# Altium schematic sheet V_BACKUP.SchDoc
size A4; SheetNumber: 18; SheetTotal: 21
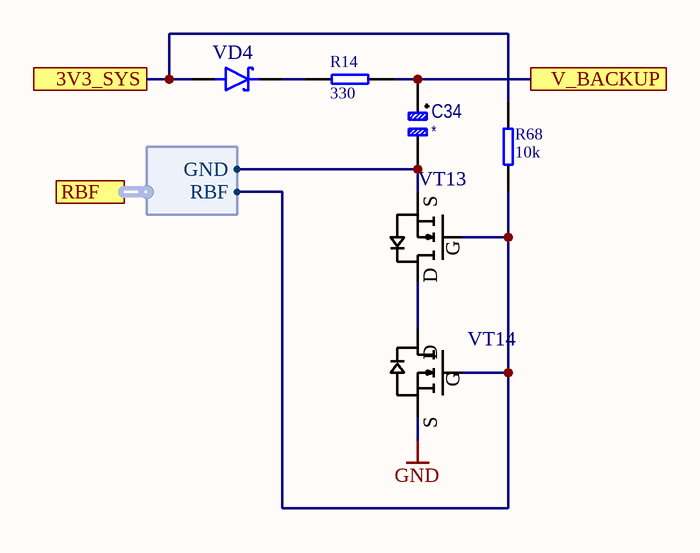
[diagram p0: V_BACKUP.SchDoc]

## Parts
C34  *  [DCS5R5224H]
R14  value 330  [RES 0402]
R68  value 10k  [RES 0402]
VD4  (no value)  [SOD-123]
VT13  2N7002  [SOT23-3]  (value not drawn)
VT14  2N7002  [SOT23-3]  (value not drawn)

## Ports
3V3_SYS, RBF (harness RBF), V_BACKUP

## Harnesses
RBF: GND, RBF

## Nets
GND: VT14.S1
3V3_SYS: R68.2 VD4.A(Anode) ; port 3V3_SYS
V_BACKUP: C34.1(+) R14.2 ; port V_BACKUP
NetC34_2: C34.2(-) VT13.S1 ; port RBF.GND
NetR14_1: R14.1 VD4.C(Cathode)
NetR68_1: R68.1 VT13.G2 VT14.G2 ; port RBF.RBF
NetVT13_D6: VT13.D6 VT14.D6

## Notes on the sheet
- (in symbol !Generic N MOSFET) D; G; S

## Library data of the parts
C34 = Ionistor: Super Capacitor; IsSMT: NoSMT; Order: *; LCSC Part #: *; BuyLink1: *; Value: *
R14 R68 = !Resistor: Resistor; IsSMT: NoSMT
VD4 = DiodeS: Diode Shottky; IsSMT: NoSMT
VT13 VT14 = !Generic N MOSFET: generic N mosfet; pin to pad: D6>3 G2>1 S1>2; IsSMT: NoSMT